# Altium schematic sheet CPCIS_Connectors.SchDoc: Grabber_DIOT
size 420 x 297 mm; CompanyName: WUT; DrawnBy: MMroz; Organization: WUT; Address1: Warsaw Univeristy of Technology; Address2: Nowowiejska 15/19; SheetNumber: 5; SheetTotal: 5; SPICEModelCacheRLGUJVSZ: <root> / <DocumentId>RLGUJVSZ</DocumentId> / </root>; Title2: CPCIS_Connectors
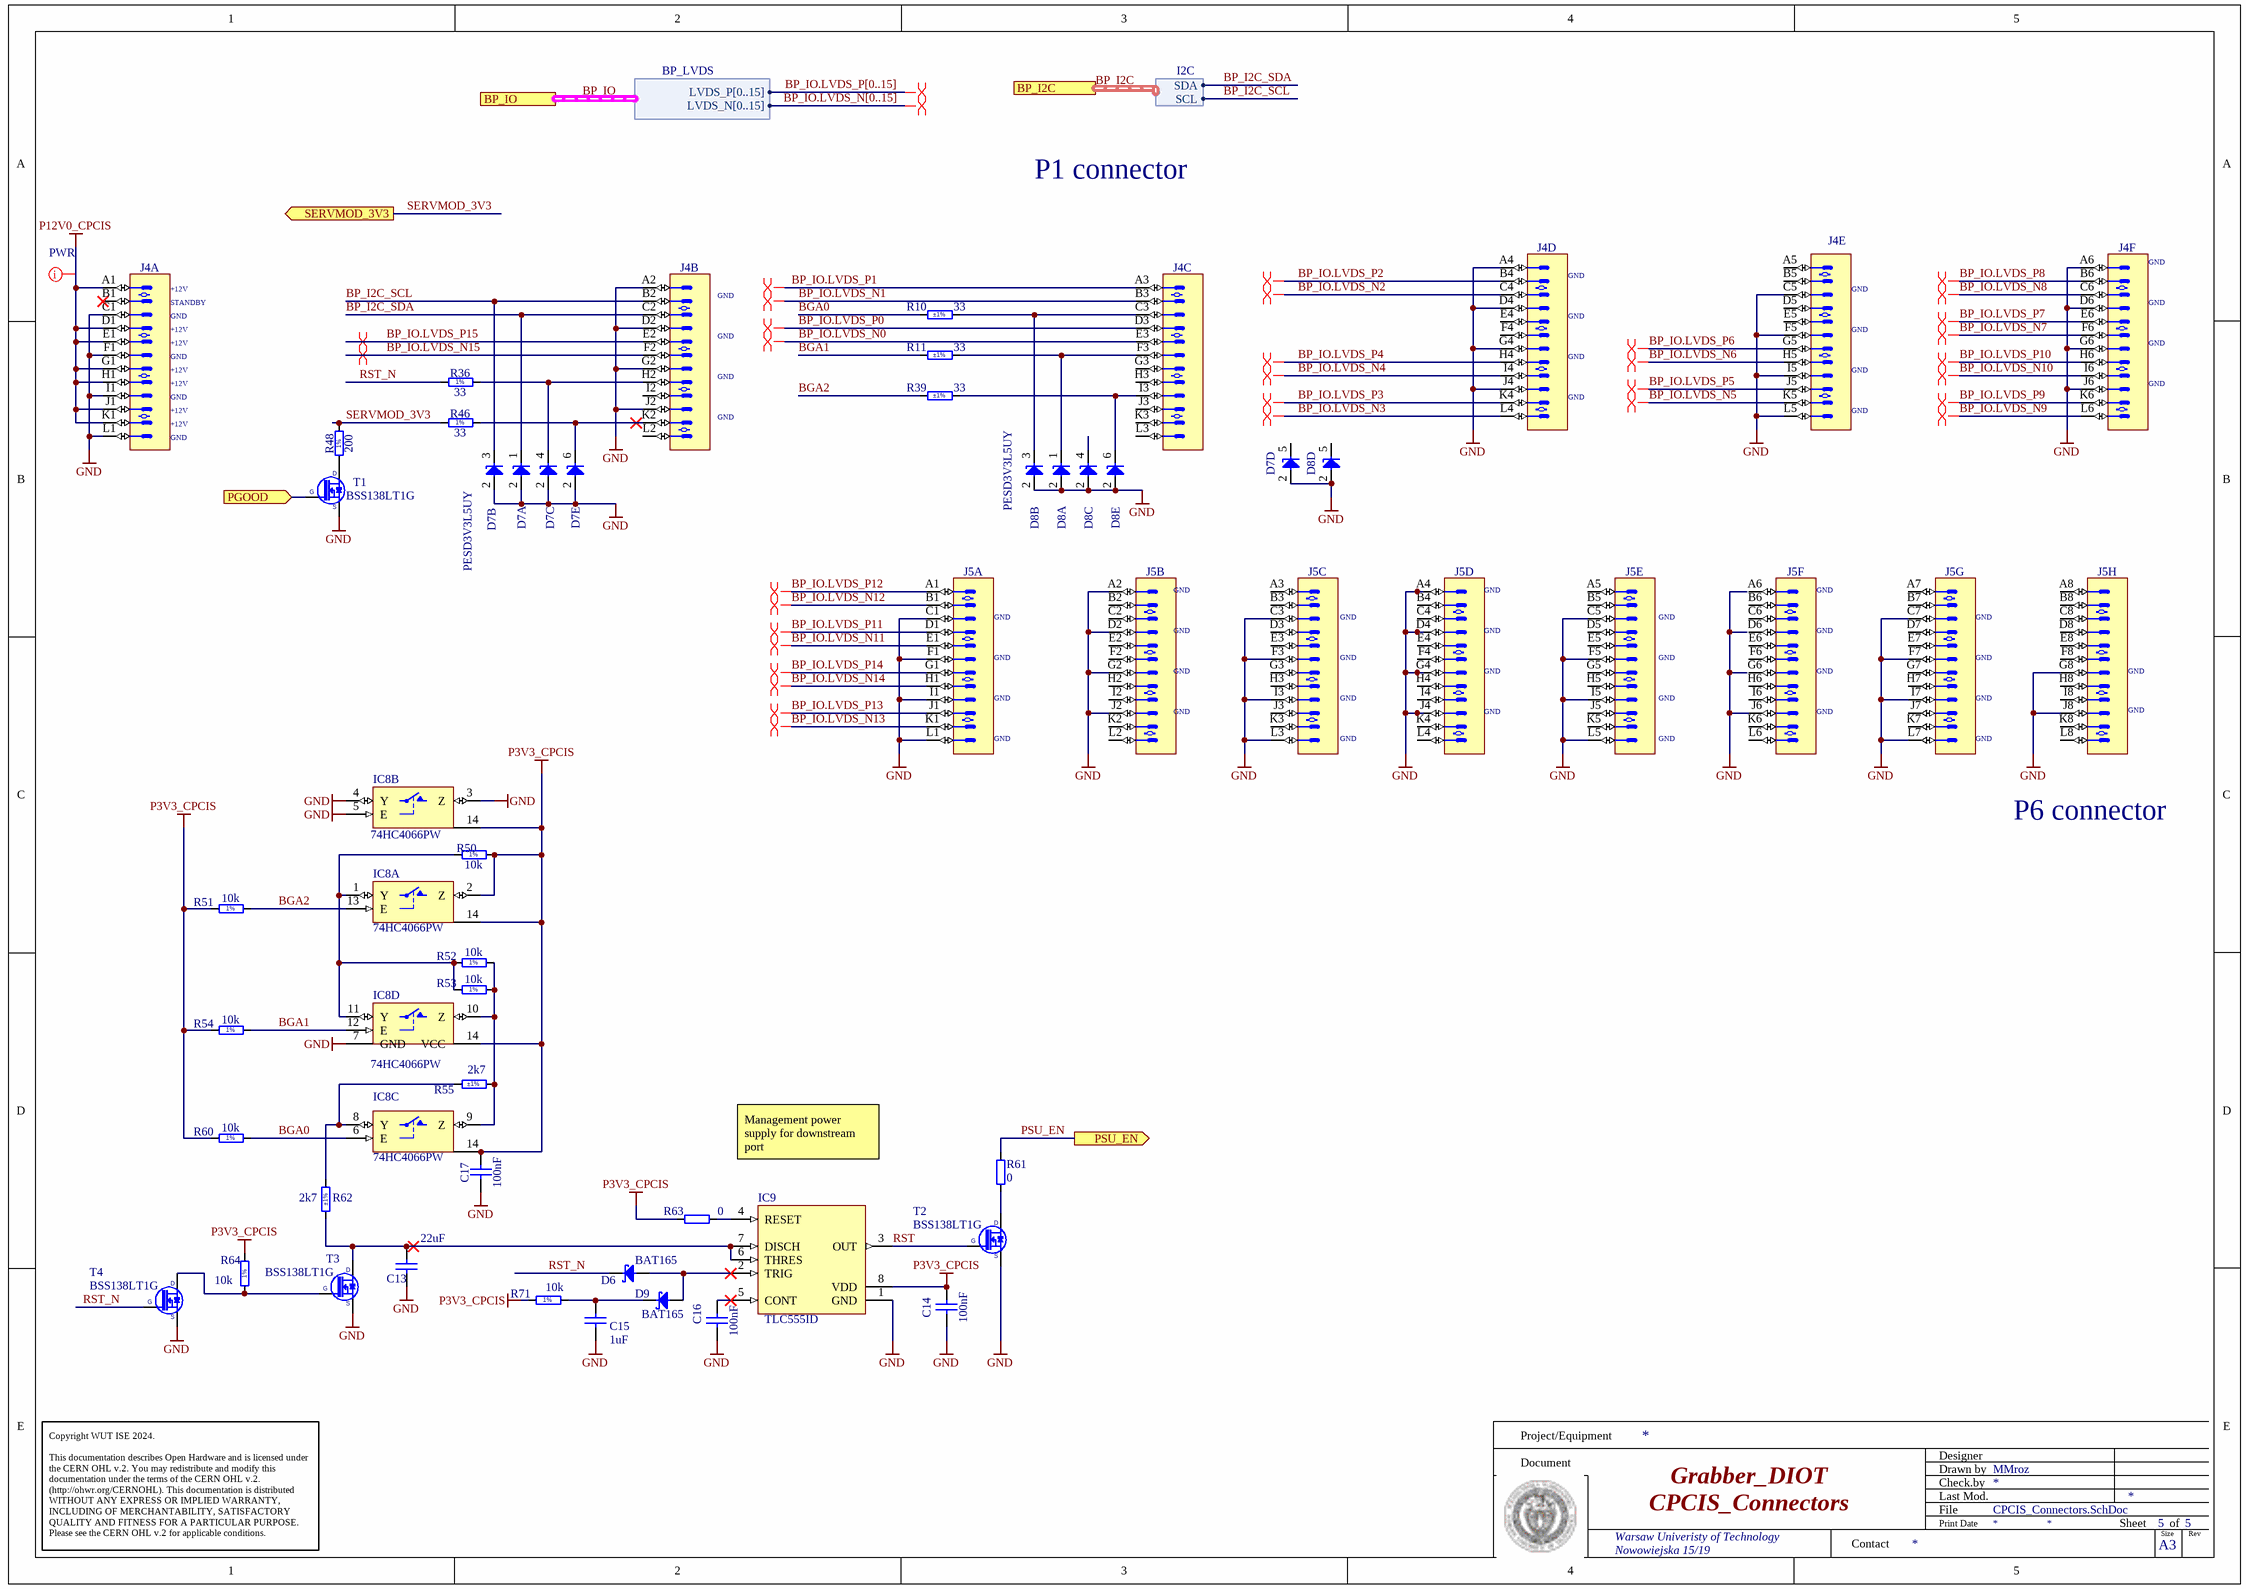
[diagram p0: CPCIS_Connectors.SchDoc]

## Parts
C13  22uF  [CAPC2012X135N]
C14  100nF  [CAPC1005X55N]
C15  1uF  [CAPC1608X87N]
C16  100nF  [CAPC1005X55N]
C17  100nF  [CAPC1005X55N]
D6  BAT165  [SOD2512X110N]
D7  PESD3V3L5UY  [SOT65P210X110-6N]  (value not drawn)  (parts A,B,C,D,E of 5)
D8  PESD3V3L5UY  [SOT65P210X110-6N]  (value not drawn)  (parts A,B,C,D,E of 5)
D9  BAT165  [SOD2512X110N]
IC8  74HC4066PW  [SOP65P640X110-14N]  (parts A,B,C,D of 4)
IC9  TLC555ID  [SOIC127P600X175-8N]
J4  10052825-101LF  [AMPHENOL_10052825-101LF]  (value not drawn)  (parts A,B,C,D,E,F of 6)
J5  10052838-101LF  [AMPHENOL_10052838-101LF]  (value not drawn)  (parts A,B,C,D,E,F,G,H of 8)
R10  33  Tolerance: ±1%  [RESC1608X55N]
R11  33  Tolerance: ±1%  [RESC1608X55N]
R36  33  Tolerance: 1%  [RESC1005X40N]
R39  33  Tolerance: ±1%  [RESC1608X55N]
R46  33  Tolerance: 1%  [RESC1005X40N]
R48  200  [RESC1005X40N]
R50  10k  [RESC1005X40N]
R51  10k  [RESC1005X40N]
R52  10k  [RESC1005X40N]
R53  10k  [RESC1005X40N]
R54  10k  [RESC1005X40N]
R55  2k7  Tolerance: ±1%  [RESC1608X55N]
R60  10k  [RESC1005X40N]
R61  0  [RESC1005X35N]
R62  2k7  Tolerance: ±1%  [RESC1608X55N]
R63  0  [RESC1005X35N]
R64  10k  [RESC1005X40N]
R71  10k  [RESC1005X40N]
T1  BSS138LT1G  [SOT95P240X110-3N]
T2  BSS138LT1G  [SOT95P240X110-3N]
T3  BSS138LT1G  [SOT95P240X110-3N]
T4  BSS138LT1G  [SOT95P240X110-3N]

## Ports
BP_I2C (harness I2C), BP_IO (harness BP_LVDS), PGOOD (in), PSU_EN (out), SERVMOD_3V3 (out)

## Harnesses
BP_LVDS: LVDS_P[0..15], LVDS_N[0..15]
I2C: SDA, SCL

## Nets
GND: C13.1 C14.1 C15.1 C16.1 C17.1 D7.2(A) D8.2(A) IC8.3(Z) IC8.4(Y) IC8.5(E) IC8.7(GND) IC9.1(GND) J4.A2 J4.A4 J4.A6 J4.C1 J4.C5 J4.D2 J4.D4 J4.D6 J4.F1 J4.F5 J4.G2 J4.G4 J4.G6 J4.I1 J4.I5 J4.J2 J4.J4 J4.J6 J4.L1 J4.L5 J5.A2 J5.A4 J5.C1 J5.C3 J5.C5 J5.C7 J5.D2 J5.D4 J5.F1 J5.F3 J5.F5 J5.F7 J5.G2 J5.G4 J5.G8 J5.I1 J5.I3 J5.I5 J5.I7 J5.J2 J5.J4 J5.J6 J5.J8 J5.L1 J5.L3 J5.L5 J5.L7 T1.2(S) T2.2(S) T3.2(S) T4.2(S)
P3V3_CPCIS: C14.2 C17.2 IC8.2(Z) IC8.14(VCC) IC9.8(VDD) R50.2 R51.1 R54.1 R60.1 R63.2 R64.2 R71.1
P12V0_CPCIS: J4.A1 J4.D1 J4.E1 J4.G1 J4.H1 J4.J1 J4.K1
BGA0: IC8.6(E) R10.2 R60.2
BGA1: IC8.12(E) R11.2 R54.2
BGA2: IC8.13(E) R39.2 R51.2
BP_I2C_SCL: D7.3(C) J4.B2 ; port BP_I2C.SCL  [project net BP_I2C.SCL]
BP_I2C_SDA: D7.1(C) J4.C2 ; port BP_I2C.SDA  [project net BP_I2C.SDA]
BP_IO.LVDS_N0: J4.E3
BP_IO.LVDS_N1: J4.B3
BP_IO.LVDS_N2: J4.C4
BP_IO.LVDS_N3: J4.L4
BP_IO.LVDS_N4: J4.I4
BP_IO.LVDS_N5: J4.K5
BP_IO.LVDS_N6: J4.H5
BP_IO.LVDS_N7: J4.F6
BP_IO.LVDS_N8: J4.C6
BP_IO.LVDS_N9: J4.L6
BP_IO.LVDS_N10: J4.I6
BP_IO.LVDS_N11: J5.E1
BP_IO.LVDS_N12: J5.B1
BP_IO.LVDS_N13: J5.K1
BP_IO.LVDS_N14: J5.H1
BP_IO.LVDS_N15: J4.F2
BP_IO.LVDS_P0: J4.D3
BP_IO.LVDS_P1: J4.A3
BP_IO.LVDS_P2: J4.B4
BP_IO.LVDS_P3: J4.K4
BP_IO.LVDS_P4: J4.H4
BP_IO.LVDS_P5: J4.J5
BP_IO.LVDS_P6: J4.G5
BP_IO.LVDS_P7: J4.E6
BP_IO.LVDS_P8: J4.B6
BP_IO.LVDS_P9: J4.K6
BP_IO.LVDS_P10: J4.H6
BP_IO.LVDS_P11: J5.D1
BP_IO.LVDS_P12: J5.A1
BP_IO.LVDS_P13: J5.J1
BP_IO.LVDS_P14: J5.G1
BP_IO.LVDS_P15: J4.E2
PGOOD: T1.1(G) ; port PGOOD
PSU_EN: R61.1 ; port PSU_EN
RST: IC9.3(OUT) T2.1(G)
RST_N: D6.1(C) R36.1 T4.1(G)
SERVMOD_3V3: R46.1 R48.2 ; port SERVMOD_3V3
NetC13_2: C13.2 IC9.6(THRES) IC9.7(DISCH) R62.2 T3.3(D)
NetC15_2: C15.2 D9.1(C) R71.2
NetC16_2: C16.2 IC9.5(CONT)
NetD6_2: D6.2(A) D9.2(A) IC9.2(TRIG)
NetD7_4: D7.4(C) J4.H2 R36.2
NetD7_6: D7.6(C) J4.K2 R46.2
NetD8_1: D8.1(C) J4.F3 R11.1
NetD8_3: D8.3(C) J4.C3 R10.1
NetD8_6: D8.6(C) J4.I3 R39.1
NetIC8_1: IC8.1(Y) IC8.11(Y) R50.1 R52.1 R53.1
NetIC8_8: IC8.8(Y) R55.1 R62.1
NetIC8_9: IC8.9(Z) IC8.10(Z) R52.2 R53.2 R55.2
NetIC9_4: IC9.4(RESET) R63.1
NetR48_1: R48.1 T1.3(D)
NetR61_2: R61.2 T2.3(D)
NetR64_1: R64.1 T3.1(G) T4.3(D)

Not connected (* = marked no-connect by the designer): D7 5(C); D8 4(C) 5(C); J4 A5 B1* B5 D5 E4 E5 F4 G3 H3 I2 J3 K3 L2 L3; J5 A3 A5 A6 A7 A8 B2 B3 B4 B5 B6 B7 B8 C2 C4 C6 C8 D3 D5 D6 D7 D8 E2 E3 E4 E5 E6 E7 E8 F2 F4 F6 F8 G3 G5 G6 G7 H2 H3 H4 H5 H6 H7 H8 I2 I4 I6 I8 J3 J5 J7 K2 K3 K4 K5 K6 K7 K8 L2 L4 L6 L8

## Buses and harness runs
bus BP_IO.LVDS_N[0..15]
bus BP_IO.LVDS_P[0..15]
harness BP_I2C = port BP_I2C
harness BP_IO = port BP_IO

## Layout directives
differential pair; differential pair class Diff_100Ohm: (no net found under the mark)
net class PWR: P12V0_CPCIS
differential pair: BP_IO.LVDS_N0, BP_IO.LVDS_N1, BP_IO.LVDS_N2, BP_IO.LVDS_N3, BP_IO.LVDS_N4, BP_IO.LVDS_N5, BP_IO.LVDS_N6, BP_IO.LVDS_N7, BP_IO.LVDS_N8, BP_IO.LVDS_N9, BP_IO.LVDS_N10, BP_IO.LVDS_N11, BP_IO.LVDS_N12, BP_IO.LVDS_N13, BP_IO.LVDS_N14, BP_IO.LVDS_N15, BP_IO.LVDS_P0, BP_IO.LVDS_P1, BP_IO.LVDS_P2, BP_IO.LVDS_P3, BP_IO.LVDS_P4, BP_IO.LVDS_P5, BP_IO.LVDS_P6, BP_IO.LVDS_P7, BP_IO.LVDS_P8, BP_IO.LVDS_P9, BP_IO.LVDS_P10, BP_IO.LVDS_P11, BP_IO.LVDS_P12, BP_IO.LVDS_P13, BP_IO.LVDS_P14, BP_IO.LVDS_P15

## Notes on the sheet
- P1 connector
- (near J4) GND
- (near J4) +12V
- (near J4) STANDBY
- (near J5) GND
- P6 connector
- Management power supply for downstream port
- Project/Equipment
- Document
- Designer
- Drawn by
- Check.by
- Copyright WUT ISE 2024.
  This documentation describes Open Hardware and is licensed under the CERN OHL v.2. You may redistribute and modify this documentation under the terms of the CERN OHL v.2. (http://ohwr.org/CERNOHL). This documentation is distributed WITHOUT ANY EXPRESS OR IMPLIED WARRANTY, INCLUDING OF MERCHANTABILITY, SATISFACTORY QUALITY AND FITNESS FOR A PARTICULAR PURPOSE. Please see the CERN OHL v.2 for applicable conditions.
- Contact
- File
- Last Mod.
- Print Date
- Sheet
- Size
- A3
- of
- Rev
- (in symbol R0402_10K_1%_0.0625W_100PPM) 1%
- (in symbol R0402_200R_1%_0.0625W_100PPM) 1%

## Library data of the parts
C13 = CC0805_22UF_16V_10%_X5R: Non-polarised capacitor; Part Description: SMD Multilayer Chip Ceramic Capacitor; Manufacturer: GENERIC; Manufacturer1 Part Number: C2012X5R1C226KT; Voltage: 16V; TC: X5R; Tolerance: ±10%; Part Number: CC0805_22UF_16V_10%_X5R; Component Kind: Standard; Component Type: Standard; Pin Count: 2; Value: 22uF; Status: Preferred; Manufacturer Part Number: CC0805_22UF_16V_10%_X5R; Case: 0805; Mounted: Yes; Socket: No; SMD: Yes; Sense: No; Manufacturer1 Example: TDK; Manufacturer1 ComponentHeight: 1.35mm; HelpURL: \\cern.ch\dfs\Applications\Altium\Datasheets\CC0805_X5R_TDK_C.pdf; Author: CERN DEM JLC; CreateDate: 25.10.2012; LatestRevisionDate: 25.10.2012
C14 C16 C17 = CC0402_100NF_16V_10%_X5R: Non-polarised capacitor; Part Description: SMD Multilayer Chip Ceramic Capacitor; Manufacturer: GENERIC; Manufacturer1 Part Number: GRM155R61C104KA88D; Voltage: 16V; TC: X5R; Tolerance: ±10%; Part Number: CC0402_100NF_16V_10%_X5R; Component Kind: Standard; Component Type: Standard; Pin Count: 2; Value: 100nF; Status: None; Manufacturer Part Number: CC0402_100NF_16V_10%_X5R; Case: 0402; Mounted: Yes; Socket: No; SMD: Yes; Sense: No; Manufacturer1 Example: MURATA; Manufacturer1 ComponentHeight: 0.55mm; HelpURL: \\cern.ch\dfs\Applications\Altium\Datasheets\CC0402_X5R_MURATA_GRM.pdf; Author: CERN DEM JLC; CreateDate: 10.12.2013; LatestRevisionDate: 10.12.2013
C15 = CC0603_1UF_16V_10%_X7R: Non-polarised capacitor; Part Description: SMD Multilayer Chip Ceramic Capacitor; Manufacturer: GENERIC; Manufacturer1 Part Number: 223878615663; Voltage: 16V; TC: X7R; Tolerance: ±10%; Part Number: CC0603_1UF_16V_10%_X7R; Component Kind: Standard; Component Type: Standard; Pin Count: 2; Value: 1uF; Status: None; Manufacturer Part Number: CC0603_1UF_16V_10%_X7R; Case: 0603; Mounted: Yes; Socket: No; SMD: Yes; Sense: No; Manufacturer1 Example: YAGEO PHYCOMP; Manufacturer1 ComponentHeight: 0.9mm; HelpURL: \\cern.ch\dfs\Applications\Altium\Datasheets\CC0603_X7R_PHYCOMP.pdf; Author: CERN DEM JLC; CreateDate: 03.12.2007; LatestRevisionDate: 17.04.2015
D6 D9 = BAT165: Schottky Diode; Manufacturer: INFINEON; Part Description: Medium Power AF Schottky Diode; Voltage: 40V; Power: 750mA; PressFit: No; Bonding: No; Manufacturer Part Number: BAT165; PackageDescription: Small Outline Diode (SOD-323), 1.70mm W X 1.25mm L X 1.10mm H body,  IPC Medium Density; Part Number: BAT165; Component Kind: Standard; Component Type: Standard; Device: BAT165; Pin Count: 2; Case: SOD323; Mounted: Yes; Socket: No; SMD: Yes; Sense: No; ComponentHeight: 1.1mm; HelpURL: \\cern.ch\dfs\Applications\Altium\Datasheets\BAT165.pdf; Author: CERN DEM JLC; CreateDate: 12.11.2014; LatestRevisionDate: 12.11.2014
D7 D8 = PESD3V3L5UY: Fivefold ESD Protection Diode Arrays; Part Description: Fivefold ESD Protection Diode Arrays (30kV); Manufacturer: NEXPERIA; Voltage: 3.3V; Power: 200W; PressFit: No; Bonding: No; Part Number: PESD3V3L5UY; Component Kind: Standard; Component Type: Standard; Device: PESD3V3L5UY; PackageDescription: SOT363, SC-88, 0.65mm Pitch; 6 Pin, 1.25mm W X 2.00mm L X 1.10mm H body, IPC Medium Density; Manufacturer Part Number: PESD3V3L5UY; Pin Count: 6; Case: SOT363; Mounted: Yes; Socket: No; SMD: Yes; Sense: No; ComponentHeight: 1.1mm; HelpURL: \\cern.ch\dfs\Applications\Altium\Datasheets\PESD3V3L5UY.pdf; Author: CERN DEM WB; CreateDate: 05.07.2021; LatestRevisionDate: 05.07.2021
IC8 = 74HC4066PW: Part Description: Quad Single-Pole Single-Throw Analog Switch; Manufacturer: NXP SEMICONDUCTORS; PressFit: No; Bonding: No; Table: Standard Logic; Part Number: 74HC4066PW; Component Kind: Standard; Component Type: Standard; Device: 74HC4066PW; PackageDescription: SOP, 14-Leads, Body 4.4x5mm (max), Pitch 0.65mm, IPC Medium Density; Manufacturer Part Number: 74HC4066PW; Pin Count: 14; Case: TSSOP14; Mounted: Yes; Socket: No; SMD: Yes; ComponentHeight: 1.1mm; Author: CERN DEM JLC; HelpURL: \\cern.ch\dfs\Applications\Altium\Datasheets\74HC4066PW.pdf; CreateDate: 2014-11-19; LatestRevisionDate: 2014-11-19
IC9 = TLC555ID: LinCMOS Timer; Manufacturer: TEXAS INSTRUMENTS; PressFit: No; Bonding: No; Part Number: TLC555ID; Component Kind: Standard; Component Type: Standard; Device: TLC555ID; PackageDescription: SOIC 8, Pitch 1.27mm, Body 4x5mm, IPC Medium Density; Part Description: LinCMOS Timer; Manufacturer Part Number: TLC555ID; Pin Count: 8; Case: SOIC8; Mounted: Yes; Socket: No; SMD: Yes; Sense: No; ComponentHeight: 1.75mm; Author: CERN DEM JMW; HelpURL: \\cern.ch\dfs\Applications\Altium\Datasheets\TLC555ID.pdf; CreateDate: 23.08.2016; LatestRevisionDate: 23.08.2016
J4 = AMPHENOL_10052825-101LF: 72 Contacts Header, 6 Columns, 4 Pairs per Column; Manufacturer: AMPHENOL; Part Number: 10052825-101LF
J5 = AMPHENOL_10052838-101LF: 96 Contacts Header, 8 Columns, 4 Pairs per Column; Manufacturer: AMPHENOL; Part Number: 10052838-101LF
R10 R11 R39 = R0603_33R_1%_0.1W_100PPM: Resistor - 1%; Part Description: General Purpose Thick Film Chip Resistor; Manufacturer: GENERIC; Manufacturer1 Part Number: NRC06F33R0TRF; Power: 0.1W; TC: ±100ppm/°C; PressFit: No; Part Number: R0603_33R_1%_0.1W_100PPM; Component Kind: Standard; Component Type: Standard; Pin Count: 2; Value: 33; Status: Preferred; Manufacturer Part Number: R0603_33R_1%_0.1W_100PPM; Case: 0603; Mounted: Yes; Sense: No; Socket: No; SMD: Yes; Manufacturer1 Example: NIC COMPONENT; Manufacturer1 ComponentHeight: 0.55mm; HelpURL: \\cern.ch\dfs\Applications\Altium\Datasheets\R0603_NIC_NRC.pdf; Author: CERN DEM JLC; CreateDate: 03.12.2007; LatestRevisionDate: 13.03.2008
R36 R46 = Resistor - 1%
R48 = R0402_200R_1%_0.0625W_100PPM: Resistor - 1%; Part Description: General Purpose Thick Film Chip Resistor; Manufacturer: GENERIC; Manufacturer1 Part Number: 232270672001L; TC: ±100ppm/°C; PressFit: No; Part Number: R0402_200R_1%_0.0625W_100PPM; Component Kind: Standard; Component Type: Standard; Pin Count: 2; Value: 200; Status: Not Recommended; Power: 0.0625W; Tolerance: ±1%; Manufacturer Part Number: R0402_200R_1%_0.0625W_100PPM; Case: 0402; Mounted: Yes; Sense: No; Socket: No; SMD: Yes; Manufacturer1 Example: YAGEO PHYCOMP; Manufacturer1 ComponentHeight: 0.4mm; HelpURL: \\cern.ch\dfs\Applications\Altium\Datasheets\R0402_Phycomp_RC0402.pdf; Author: CERN DEM JLC; CreateDate: 2007-12-03; LatestRevisionDate: 2012-10-17
R50-R54 R60 R64 R71 = R0402_10K_1%_0.0625W_100PPM: Resistor - 1%; Part Description: General Purpose Thick Film Chip Resistor; Manufacturer: GENERIC; Manufacturer1 Part Number: 232270671003L; TC: ±100ppm/°C; Part Number: R0402_10K_1%_0.0625W_100PPM; Component Kind: Standard; Component Type: Standard; Pin Count: 2; Value: 10k; Status: Not recommended; Power: 0.0625W; Tolerance: ±1%; Manufacturer Part Number: R0402_10K_1%_0.0625W_100PPM; Case: 0402; Mounted: Yes; Sense: No; Socket: No; SMD: Yes; Manufacturer1 Example: YAGEO PHYCOMP; Manufacturer1 ComponentHeight: 0.4mm; HelpURL: \\cern.ch\dfs\Applications\Altium\Datasheets\R0402_Phycomp_RC0402.pdf; Author: CERN DEM JLC; CreateDate: 03.12.2007; LatestRevisionDate: 17.10.2012
R55 R62 = R0603_2K7_1%_0.1W_100PPM: Resistor - 1%; Part Description: General Purpose Thick Film Chip Resistor; Manufacturer: GENERIC; Manufacturer1 Part Number: RC0603FR-072K7L; Power: 0.1W; TC: ±100ppm/°C; PressFit: No; Part Number: R0603_2K7_1%_0.1W_100PPM; Component Kind: Standard; Component Type: Standard; Pin Count: 2; Value: 2k7; Status: Preferred; Manufacturer Part Number: R0603_2K7_1%_0.1W_100PPM; Case: 0603; Mounted: Yes; Sense: No; Socket: No; SMD: Yes; Manufacturer1 Example: YAGEO PHYCOMP; Manufacturer1 ComponentHeight: 0.55mm; HelpURL: \\cern.ch\dfs\Applications\Altium\Datasheets\R0603_PHYCOMP_RC0603.pdf; Author: CERN DEM JLC; CreateDate: 02.05.2011; LatestRevisionDate: 02.05.2011
R61 R63 = R0402_0R_JUMPER: Resistor; Part Description: 1A (0.05R Max DC Resistance) Zero Ohm Jumper; Manufacturer: GENERIC; Manufacturer1 Part Number: 232270591001L; Part Number: R0402_0R_JUMPER; Component Kind: Standard; Component Type: Standard; Footprint: RESC1005X40N; Pin Count: 2; Value: 0; Status: Not recommended; Manufacturer Part Number: R0402_0R_JUMPER; Case: 0402; Mounted: Yes; Sense: No; Socket: No; SMD: Yes; Manufacturer1 Example: YAGEO PHYCOMP; Manufacturer1 ComponentHeight: 0.4mm; HelpURL: \\cern.ch\dfs\Applications\Altium\Datasheets\R0402_Phycomp_RC0402.pdf; Author: CERN DEM JLC; CreateDate: 03.12.2007; LatestRevisionDate: 17.10.2012
T1-T4 = BSS138LT1G: N-CHANNEL MOSFET WITH DIODE; Part Description: 50V, 200mA N-Channel Enhancement Mode Field-Effect Transistor; Manufacturer: ON SEMICONDUCTOR; PressFit: No; Bonding: No; Part Number: BSS138LT1G; Component Kind: Standard; Component Type: Standard; Device: BSS138LT1G; PackageDescription: SOT23, 0.95mm Pitch; 3 Pin, 1.40mm W X 3.00mm L X 1.10mm H body, IPC Medium Density; Manufacturer Part Number: BSS138L; Pin Count: 3; Case: SOT23-3; Mounted: Yes; Socket: No; SMD: Yes; Sense: No; ComponentHeight: 1.11mm; HelpURL: \\cern.ch\dfs\Applications\Altium\Datasheets\BSS138LT1G.pdf; Author: CERN DEM JLC; CreateDate: 23.03.2009; LatestRevisionDate: 25.05.2022